# Altium schematic sheet SoC.SchDoc
size A4; SheetNumber: 2; SheetTotal: 3
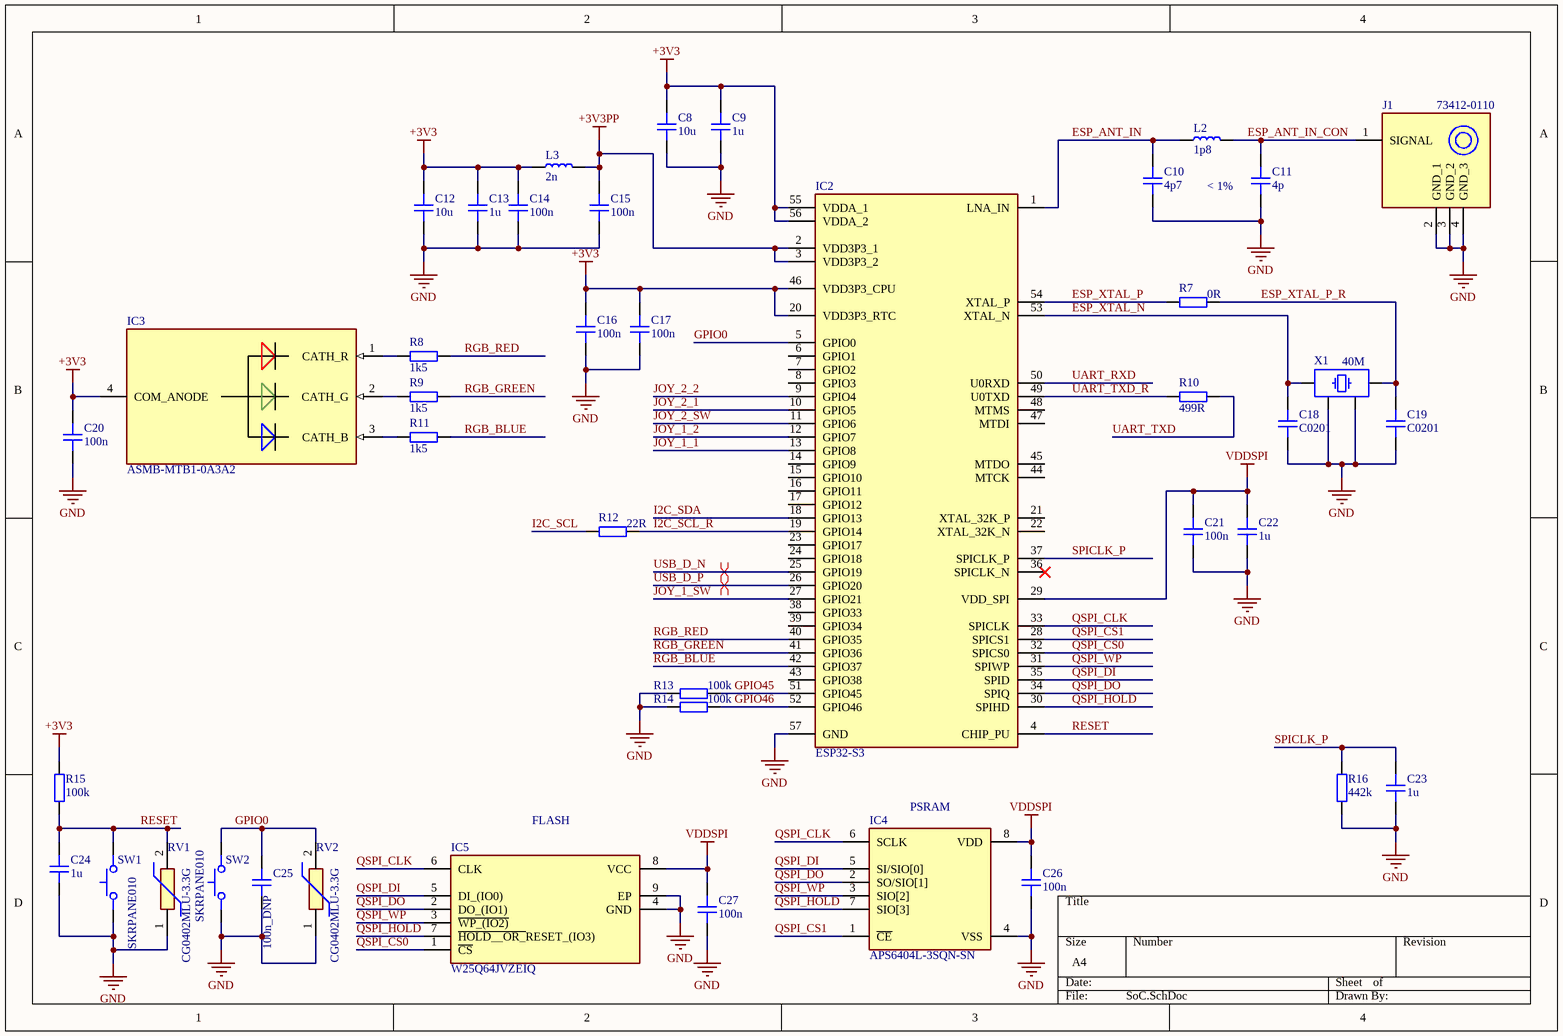
[diagram p0: SoC.SchDoc]

## Parts
C8  10u  [CAP_0402]
C9  1u  [CAP_0201]
C10  4p7  [CAP_0201]
C11  4p  [CAP_0201]
C12  10u  [CAP_0402]
C13  1u  [CAP_0201]
C14  100n  [CAP_0201]
C15  100n  [CAP_0201]
C16  100n  [CAP_0201]
C17  100n  [CAP_0201]
C18  C0201  [CAP_0201]
C19  C0201  [CAP_0201]
C20  100n  [CAP_0201]
C21  100n  [CAP_0201]
C22  1u  [CAP_0201]
C23  1u  [CAP_0201]
C24  1u  [CAP_0201]
C25  100n_DNP  [CAP_0201]
C26  100n  [CAP_0201]
C27  100n  [CAP_0201]
IC2  ESP32-S3  [ESP32QFN40P700X700X90-57N-D]
IC3  ASMB-MTB1-0A3A2  [AVAGO_PLCC4]
IC4  APS6404L-3SQN-SN  [SOIC127P600X175-8N - duplicate]
IC5  W25Q64JVZEIQ  [SON127P800X600X80-9N-D]
J1  73412-0110  [73412-0110]
L2  1p8  [IND_0201]
L3  2n  [IND_0201]
R7  0R  [RES_0201]
R8  1k5  [RES_0402]
R9  1k5  [RES_0402]
R10  499R  [RES_0201]
R11  1k5  [RES_0402]
R12  22R  [RES_0201]
R13  100k  [RES_0201]
R14  100k  [RES_0201]
R15  100k  [RES_0201]
R16  442k  [RES_0201]
RV1  CG0402MLU-3.3G  [VARC1005X41N]
RV2  CG0402MLU-3.3G  [VARC1005X41N]
SW1  SKRPANE010  [SKRPANE010]
SW2  SKRPANE010  [SKRPANE010]
X1  40M  [XTAL_2016]

## Nets
+3V3: C8.2 C9.2 C12.2 C13.2 C14.2 C16.2 C17.2 C20.2 IC2.20(VDD3P3_RTC) IC2.46(VDD3P3_CPU) IC2.55(VDDA_1) IC2.56(VDDA_2) IC3.4(COM_ANODE) L3.1 R15.2
+3V3PP: C15.2 IC2.2(VDD3P3_1) IC2.3(VDD3P3_2) L3.2
GND: C8.1 C9.1 C10.1 C11.1 C12.1 C13.1 C14.1 C15.1 C16.1 C17.1 C18.1 C19.1 C20.1 C21.1 C22.1 C23.1 C24.1 C25.1 C26.1 C27.1 IC2.57(GND) IC4.4(VSS) IC5.4(GND) IC5.9(EP) J1.2(GND_1) J1.3(GND_2) J1.4(GND_3) R13.2 R14.2 R16.1 RV1.1 RV2.1 SW1.12 SW2.12 X1.2 X1.4
VDDSPI: C21.2 C22.2 C26.2 C27.2 IC2.29(VDD_SPI) IC4.8(VDD) IC5.8(VCC)
ESP_ANT_IN: C10.2 IC2.1(LNA_IN) L2.1
ESP_ANT_IN_CON: C11.2 J1.1(SIGNAL) L2.2
ESP_XTAL_N: C18.2 IC2.53(XTAL_N) X1.1
ESP_XTAL_P: IC2.54(XTAL_P) R7.2
ESP_XTAL_P_R: C19.2 R7.1 X1.3
GPIO0: C25.2 IC2.5(GPIO0) RV2.2 SW2.34
GPIO45: IC2.51(GPIO45) R13.1
GPIO46: IC2.52(GPIO46) R14.1
I2C_SCL: R12.2
I2C_SCL_R: IC2.19(GPIO14) R12.1
I2C_SDA: IC2.18(GPIO13)
JOY_1_1: IC2.13(GPIO8)
JOY_1_2: IC2.12(GPIO7)
JOY_1_SW: IC2.27(GPIO21)
JOY_2_1: IC2.10(GPIO5)
JOY_2_2: IC2.9(GPIO4)
JOY_2_SW: IC2.11(GPIO6)
QSPI_CLK: IC2.33(SPICLK) IC4.6(SCLK) IC5.6(CLK)
QSPI_CS0: IC2.32(SPICS0) IC5.1(~{CS})
QSPI_CS1: IC2.28(SPICS1) IC4.1(~{CE})
QSPI_DI: IC2.35(SPID) IC4.5(SI/SIO[0]) IC5.5(DI_(IO0))
QSPI_DO: IC2.34(SPIQ) IC4.2(SO/SIO[1]) IC5.2(DO_(IO1))
QSPI_HOLD: IC2.30(SPIHD) IC4.7(SIO[3]) IC5.7(~{HOLD__OR_}RESET_(IO3))
QSPI_WP: IC2.31(SPIWP) IC4.3(SIO[2]) IC5.3(~{WP_(IO2)})
RESET: C24.2 IC2.4(CHIP_PU) R15.1 RV1.2 SW1.34
RGB_BLUE: IC2.42(GPIO37) R11.2
RGB_GREEN: IC2.41(GPIO36) R9.2
RGB_RED: IC2.40(GPIO35) R8.2
SPICLK_P: C23.2 IC2.37(SPICLK_P) R16.2
UART_RXD: IC2.50(U0RXD)
UART_TXD: R10.1
UART_TXD_R: IC2.49(U0TXD) R10.2
USB_D_N: IC2.25(GPIO19)
USB_D_P: IC2.26(GPIO20)
NetIC3_1: IC3.1(CATH_R) R8.1
NetIC3_2: IC3.2(CATH_G) R9.1
NetIC3_3: IC3.3(CATH_B) R11.1

Not connected (* = marked no-connect by the designer): IC2 6(GPIO1) 7(GPIO2) 8(GPIO3) 14(GPIO9) 15(GPIO10) 16(GPIO11) 17(GPIO12) 21(XTAL_32K_P) 22(XTAL_32K_N) 23(GPIO17) 24(GPIO18) 36(SPICLK_N)* 38(GPIO33) 39(GPIO34) 43(GPIO38) 44(MTCK) 45(MTDO) 47(MTDI) 48(MTMS)

## Layout directives
differential pair: USB_D_N, USB_D_P

## Notes on the sheet
- < 1%
- (near IC5) FLASH
- (near IC4) PSRAM

## Library data of the parts
C8 C12 = CAP_0402: Capacitor SMD 0402; Manufacturer: *; Manufacturer Part Number: *; Distributor Link: *; LCSC: *; Rating: *; Dielectric: *
C9-C11 C13-C27 = CAP_0201: Capacitor SMD 0201; Manufacturer: *; Manufacturer Part Number: *; Distributor Link: *; LCSC: *; Rating: *; Dielectric: *
IC2 = ESP32-S3: Integrated Circuit; Manufacturer_Name: Espressif Systems; Datasheet Link: https://nl.mouser.com/datasheet/2/891/Espressif_ESP32_S3_Datasheet-2904763.pdf; Height: 0.9mm; Manufacturer_Part_Number: ESP32-S3; Mouser Part Number: 356-ESP32-S3; Mouser Price/Stock: https://www.mouser.co.uk/ProductDetail/Espressif-Systems/ESP32-S3?qs=Rp5uXu7WBW%2FNWuUy%252BBihNw%3D%3D
IC3 = ASMB-MTB1-0A3A2: Integrated Circuit; Manufacturer_Name: Avago Technologies; Datasheet Link: https://docs.broadcom.com/docs/AV02-4194EN; Manufacturer_Part_Number: ASMB-MTB1-0A3A2; Mouser Part Number: 630-ASMB-MTB1-0A3A2; Mouser Price/Stock: https://www.mouser.co.uk/ProductDetail/Broadcom-Avago/ASMB-MTB1-0A3A2?qs=ToP8pWlZ0bM7NIiOojjztA%3D%3D
IC4 = APS6404L-3SQN-SN: Integrated Circuit; Manufacturer_Name: AP Memory; Datasheet Link: https://www.apmemory.com/wp-content/uploads/APM_PSRAM_E3_QSPI-APS6404L-3SQN-v2.4-KGD_PKG.pdf; Height: 1.75mm; Manufacturer_Part_Number: APS6404L-3SQN-SN; Mouser Part Number: 878-APS6404L-3SQN-SN; Mouser Price/Stock: https://www.mouser.co.uk/ProductDetail/AP-Memory/APS6404L-3SQN-SN?qs=IS%252B4QmGtzzqCot9%252BeIJwKw%3D%3D
IC5 = W25Q64JVZEIQ: Integrated Circuit; Manufacturer_Name: Winbond; Datasheet Link: https://www.winbond.com/hq/search-resource-file.jsp?partNo=W25Q64JVZEIQ&type=datasheet; Height: 0.8mm; Manufacturer_Part_Number: W25Q64JVZEIQ; Mouser Part Number: 454-W25Q64JVZEIQ; Mouser Price/Stock: https://www.mouser.co.uk/ProductDetail/Winbond/W25Q64JVZEIQ?qs=qSfuJ%252Bfl%2Fd5SLf3zhXauzA%3D%3D; Arrow Part Number: W25Q64JVZEIQ; Arrow Price/Stock: https://www.arrow.com/en/products/w25q64jvzeiq/winbond-electronics?utm_currency=USD&region=nac
J1 = 73412-0110: Connector; Manufacturer_Name: Molex; Datasheet Link: http://www.molex.com/pdm_docs/sd/734120110_sd.pdf; Manufacturer_Part_Number: 73412-0110; Mouser Part Number: 538-73412-0110; Mouser Price/Stock: https://www.mouser.co.uk/ProductDetail/Molex/73412-0110?qs=NlNVDDZd7xQHV8e0ilpSdQ%3D%3D; Arrow Part Number: 73412-0110; Arrow Price/Stock: https://www.arrow.com/en/products/73412-0110/molex?region=nac
L2 L3 = IND_0201: Inductor SMD 0201; Manufacturer_Name: Murata Electronics; Manufacturer_Part_Number: LQP03HQ56NH02D; Datasheet Link: https://psearch.en.murata.com/inductor/product/LQP03HQ56NH02%23.html; Height: 0.42mm; Mouser Part Number: 81-LQP03HQ56NH02D; Mouser Price/Stock: https://www.mouser.co.uk/ProductDetail/Murata-Electronics/LQP03HQ56NH02D?qs=B6kkDfuK7%2FBQu1Ob9%2FT2Bg%3D%3D
R7 R10 R12-R16 = RES_0201: Resistor SMD 0201; Manufacturer: *; Manufacturer Part Number: *; Distributor Link: *; LCSC: *
R8 R9 R11 = RES_0402: Resistor SMD 0402; Manufacturer: *; Manufacturer Part Number: *; Distributor Link: *; LCSC: *
RV1 RV2 = CG0402MLU-3.3G: ESD Diode; Manufacturer_Name: Bourns; Datasheet Link: https://www.bourns.com/docs/Product-Datasheets/MLU.pdf; Height: 0.41mm; Manufacturer_Part_Number: CG0402MLU-3.3G; Mouser Part Number: 652-CG0402MLU-3.3G; Mouser Price/Stock: https://www.mouser.co.uk/ProductDetail/Bourns/CG0402MLU-3.3G?qs=m8myXnDJXpWVM8EQWErxtQ%3D%3D; Arrow Part Number: CG0402MLU-3.3G; Arrow Price/Stock: https://www.arrow.com/en/products/cg0402mlu-3.3g/bourns?utm_currency=USD&region=nac
SW1 SW2 = SKRPANE010: Tactile Switch SMD SPST; Manufacturer: Alps Alpine; Manufacturer Part Number: SKRPANE010
X1 = XTAL_2016: Crystal SMD 4-Pin 2.0x1.6mm; Distributor Link: *